# Altium schematic sheet Esquema_Display.SchDoc
size A4
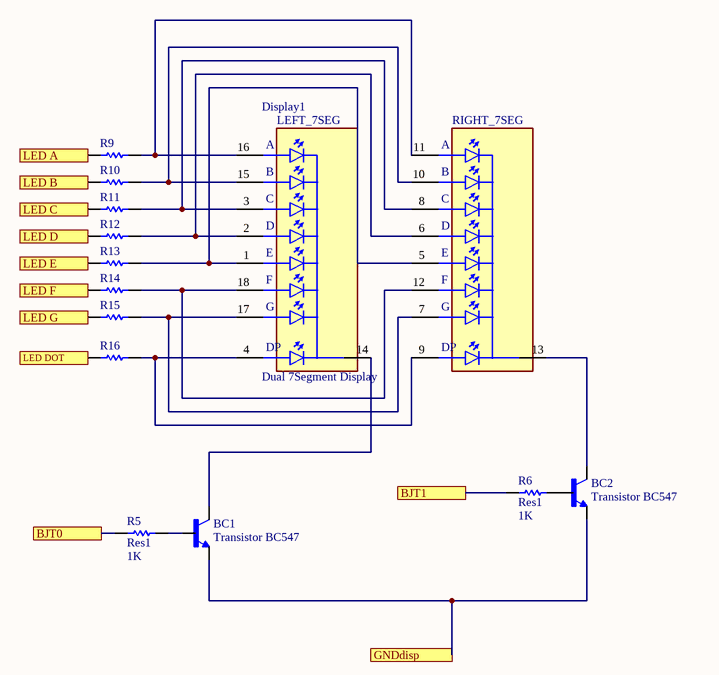
[diagram p0: Esquema_Display.SchDoc]

## Parts
BC1  Transistor BC547  [Transistor BC547]
BC2  Transistor BC547  [Transistor BC547]
Display1  Dual 7Segment Display  [Dual Digit Display]
R5  Res1  value 1K  [AXIAL-0.3]
R6  Res1  value 1K  [AXIAL-0.3]
R9  Res1  [AXIAL-0.3]  (value not drawn)
R10  Res1  [AXIAL-0.3]  (value not drawn)
R11  Res1  [AXIAL-0.3]  (value not drawn)
R12  Res1  [AXIAL-0.3]  (value not drawn)
R13  Res1  [AXIAL-0.3]  (value not drawn)
R14  Res1  [AXIAL-0.3]  (value not drawn)
R15  Res1  [AXIAL-0.3]  (value not drawn)
R16  Res1  [AXIAL-0.3]  (value not drawn)

## Ports
BJT0, BJT1, GNDdisp, LED A, LED B, LED C, LED D, LED DOT, LED E, LED F, LED G

## Nets
BJT0: R5.1 ; port BJT0
BJT1: R6.1 ; port BJT1
GNDdisp: BC1.1(E) BC2.1(E) ; port GNDdisp
LED A: R9.1 ; port LED A
LED B: R10.1 ; port LED B
LED C: R11.1 ; port LED C
LED D: R12.1 ; port LED D
LED DOT: R16.1 ; port LED DOT
LED E: R13.1 ; port LED E
LED F: R14.1 ; port LED F
LED G: R15.1 ; port LED G
NetBC1_2: BC1.2(B) R5.2
NetBC1_3: BC1.3(C) Display1.14(COM_1)
NetBC2_2: BC2.2(B) R6.2
NetBC2_3: BC2.3(C) Display1.13(COM_2)
NetDisplay1_1: Display1.1(E_1) Display1.5(E_2) R13.2
NetDisplay1_2: Display1.2(D_1) Display1.6(D_2) R12.2
NetDisplay1_3: Display1.3(C_1) Display1.8(C_2) R11.2
NetDisplay1_4: Display1.4(DP_1) Display1.9(DP_2) R16.2
NetDisplay1_7: Display1.7(G_2) Display1.17(G_1) R15.2
NetDisplay1_10: Display1.10(B_2) Display1.15(B_1) R10.2
NetDisplay1_11: Display1.11(A_2) Display1.16(A_1) R9.2
NetDisplay1_12: Display1.12(F_2) Display1.18(F_1) R14.2

## Notes on the sheet
- (in symbol Dual 7Segment Display) LEFT_7SEG; RIGHT_7SEG; A; B; C; D; E; F; G; DP

## Library data of the parts
R5 R6 = Res1: Resistor; Published: 8-Jun-2000; LatestRevisionDate: 17-Jul-2002; LatestRevisionNote: Re-released for DXP Platform.; PackageReference: AXIAL-0.3; Publisher: Altium Limited; PackageDescription: Axial Device, Thru-Hole; 2 Leads; 0.3 in Pin Spacing
R9-R16 = Res1: Resistor; Value: 1K; Published: 8-Jun-2000; LatestRevisionDate: 17-Jul-2002; LatestRevisionNote: Re-released for DXP Platform.; PackageReference: AXIAL-0.3; Publisher: Altium Limited; PackageDescription: Axial Device, Thru-Hole; 2 Leads; 0.3 in Pin Spacing